# Altium project Sim800-EC200U.PrjPcb
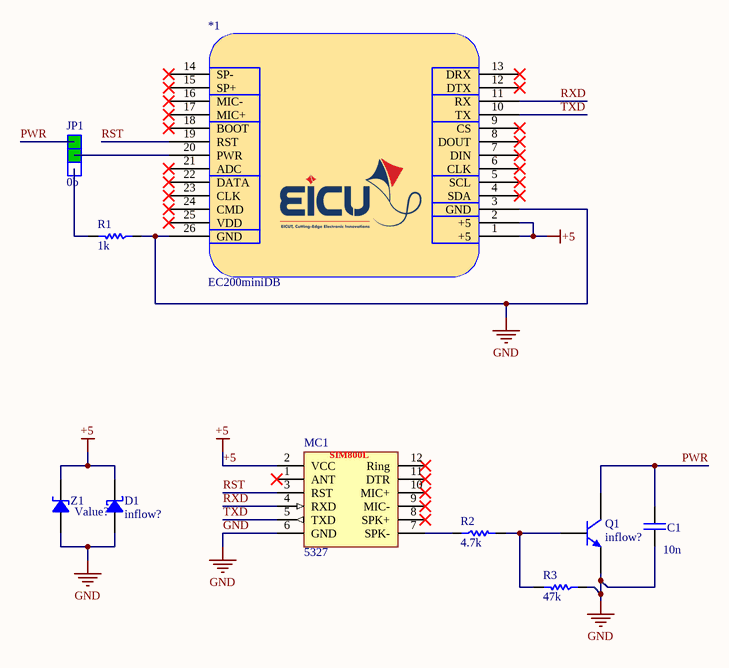
[diagram p0: main.SchDoc]
1 sheet, 10 parts. Net scope: global (net labels, ports and power ports of the same name join across sheets).
Board file: PCB.PcbDoc

## Sheet main.SchDoc
size A4; SheetNumber: 1; SheetTotal: 1

### Parts
*1  EC200miniDB  [EC200mini - NO3D]
C1  10n  [CAP 1206/3216]
D1  Inflow: inflow?  [DO214AA SMB]  (hidden comment: SMBJ15A)
JP1  0b  [Jumper Selector SMD]
MC1  Inflow: 5327  [Sim800L_Module - NO3D]  (hidden comment: Sim800L)
Q1  Inflow: inflow?  [SOT23_N]  (hidden comment: NPN)
R1  1k  [RES 1206 (3216X08L)]
R2  4.7k  [RES 1206 (3216X08L)]
R3  47k  [RES 1206 (3216X08L)]
Z1  Value?  [SOD80, LL-34]

### Nets
+5: *1.1(+5) *1.2(+5) D1.2 MC1.2(VCC) Z1.2
GND: *1.3(GND) *1.26(GND) C1.2 D1.1 MC1.6(GND) Q1.2(E) R1.1 R3.1 Z1.1
PWR: C1.1 JP1.1 Q1.3(C)
RST: *1.19(RST) MC1.3(RST)
RXD: *1.11(RX) MC1.4(RXD)
TXD: *1.10(TX) MC1.5(TXD)
Net*1_20: *1.20(PWR) JP1.2
NetJP1_3: JP1.3 R1.2
NetMC1_7: MC1.7(SPK-) R2.1
NetQ1_1: Q1.1(B) R2.2 R3.2

Not connected (* = marked no-connect by the designer): *1 4(SDA)* 5(SCL)* 6(CLK)* 7(DIN)* 8(DOUT)* 9(CS)* 12(DTX)* 13(DRX)* 14(SP-)* 15(SP+)* 16(MIC-)* 17(MIC+)* 18(BOOT)* 21(ADC)* 22(DATA)* 23(CLK)* 24(CMD)* 25(VDD)*; MC1 1(ANT)* 8(SPK+)* 9(MIC-)* 10(MIC+)* 11(DTR)* 12(Ring)*

### Notes on the sheet
- (in symbol ModSen_Com_Sim800L) SIM800L

### Library data of the parts
*1 = EC200miniDB: EICUT.com
C1 = Cap_Multi_1u_50_1206: Bipolar ceramic capacitor SMD; Rating: Rating?; Type: Type?; Validation: Valid; Inflow: 5237; Value: 10n; Package: Package?
D1 = Semi_Diod_TVS_SMBJ15A: Transil diodes provide high overvoltage protection by clamping action; Rating: 15V; Type: TVS; Validation: Valid; Value: SMBJ15A; Package: SMB
JP1 = SW_Other_JSelector_SMD: Jumper Selector; Rating: Rating?; Inflow: inflow?; Validation: Valid; Package: 0805; Type: Selector; Value: 0b
MC1 = ModSen_Com_Sim800L: SimCom GSM/GPRS Module; Rating: Rating?; Validation: NT; Value: Sim800L; Package: Dip; Type: GSM-GPRS
Q1 = Semi_BJT_BC817: NPN General purpose Transistor; Rating: Rating?; Type: Type?; Validation: Valid; Value: NPN; Package: Package?
R1-R3 = Res_SMD_1206: Resistor; Inflow: inflow?; Rating: 0.25W; Validation: Valid; Package: 1206; Type: 10%
  R1: Value: 1k
  R2: Value: 4.7k
  R3: Value: 47k
Z1 = Semi_Diod_Zener_SMD: Zener Diode; Rating: Rating?; Inflow: inflow?; Validation: Valid; Type: Zener; Package: SOD-80; Value: Value?